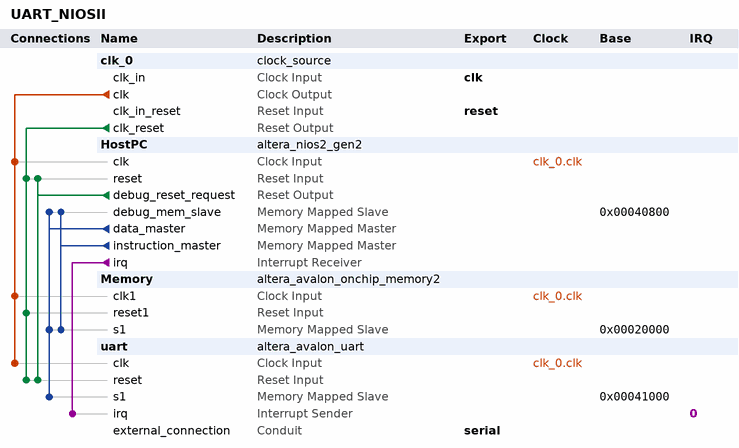
[diagram p0: system contents]
# Platform Designer (Qsys) system UART_NIOSII, Cyclone IV E EP4CE10E22A7
# Parameters at their usual value, and those the tool derives, are not listed.
package require -exact qsys 18.1
create_system UART_NIOSII
set_project_property DEVICE_FAMILY {Cyclone IV E}
set_project_property DEVICE EP4CE10E22A7

add_instance clk_0 clock_source 18.1
set_instance_parameter_value clk_0 clockFrequency 50000000

add_instance HostPC altera_nios2_gen2 18.1
set_instance_parameter_value HostPC dcache_size 2048
set_instance_parameter_value HostPC exceptionSlave Memory.s1
set_instance_parameter_value HostPC icache_size 4096
set_instance_parameter_value HostPC impl Tiny
set_instance_parameter_value HostPC resetSlave Memory.s1

add_instance Memory altera_avalon_onchip_memory2 18.1
set_instance_parameter_value Memory dataWidth 32
set_instance_parameter_value Memory dualPort false
set_instance_parameter_value Memory initMemContent true
set_instance_parameter_value Memory initializationFileName C:/Users/Siriy/Desktop/Projects/NIOS/software/Hello/mem_init/UART_NIOSII_Memory.hex
set_instance_parameter_value Memory memorySize 70000
set_instance_parameter_value Memory useNonDefaultInitFile true

add_instance uart altera_avalon_uart 18.1
set_instance_parameter_value uart baud 115200
set_instance_parameter_value uart dataBits 8
set_instance_parameter_value uart fixedBaud true
set_instance_parameter_value uart parity NONE
set_instance_parameter_value uart stopBits 1

# connections
add_connection clk_0.clk HostPC.clk clock
add_connection clk_0.clk Memory.clk1 clock
add_connection clk_0.clk uart.clk clock
add_connection clk_0.clk_reset HostPC.reset reset
add_connection clk_0.clk_reset Memory.reset1 reset
add_connection clk_0.clk_reset uart.reset reset
add_connection HostPC.debug_reset_request HostPC.reset reset
add_connection HostPC.debug_reset_request uart.reset reset
add_connection HostPC.data_master HostPC.debug_mem_slave avalon
set_connection_parameter_value HostPC.data_master/HostPC.debug_mem_slave baseAddress 0x00040800
add_connection HostPC.data_master Memory.s1 avalon
set_connection_parameter_value HostPC.data_master/Memory.s1 baseAddress 0x00020000
add_connection HostPC.data_master uart.s1 avalon
set_connection_parameter_value HostPC.data_master/uart.s1 baseAddress 0x00041000
add_connection HostPC.instruction_master HostPC.debug_mem_slave avalon
set_connection_parameter_value HostPC.instruction_master/HostPC.debug_mem_slave baseAddress 0x00040800
add_connection HostPC.instruction_master Memory.s1 avalon
set_connection_parameter_value HostPC.instruction_master/Memory.s1 baseAddress 0x00020000
add_connection HostPC.irq uart.irq interrupt
set_connection_parameter_value HostPC.irq/uart.irq irqNumber 0

# exported interfaces
add_interface clk clock sink
set_interface_property clk EXPORT_OF clk_0.clk_in
add_interface reset reset sink
set_interface_property reset EXPORT_OF clk_0.clk_in_reset
add_interface serial conduit end
set_interface_property serial EXPORT_OF uart.external_connection

set_interconnect_requirement {$system} qsys_mm.clockCrossingAdapter HANDSHAKE
set_interconnect_requirement {$system} qsys_mm.enableEccProtection FALSE
set_interconnect_requirement {$system} qsys_mm.insertDefaultSlave FALSE
set_interconnect_requirement {$system} qsys_mm.maxAdditionalLatency 1

save_system UART_NIOSII.qsys
